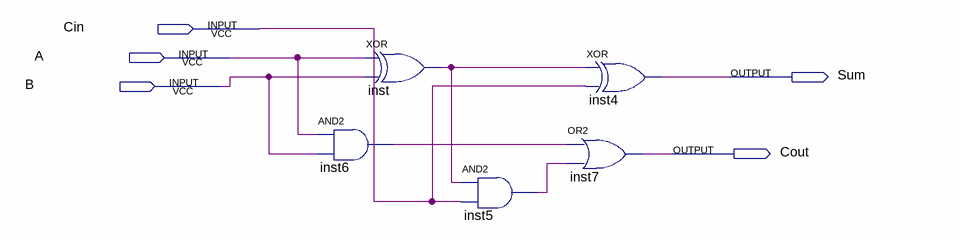
[diagram p0: schematic sheet]
// Quartus schematic FullAdder.bdf as structural Verilog: 5 symbols, 5 pins
module FullAdder (
  input  Cin,
  input  A,
  input  B,
  output Sum,
  output Cout
);

  wire inst5_out, inst6_out, inst_out;

  xor inst (inst_out, A, B);
  and inst6 (inst6_out, A, B);
  and inst5 (inst5_out, inst_out, Cin);
  xor inst4 (Sum, inst_out, Cin);
  or inst7 (Cout, inst6_out, inst5_out);
endmodule
